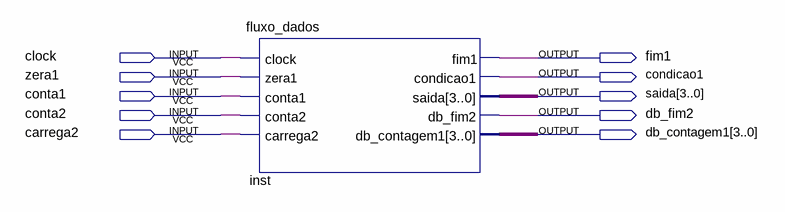
[diagram p0: schematic sheet]
// Quartus schematic fluxo_dados.bdf as structural Verilog: 1 symbols, 10 pins
module fluxo_dados (
  input  clock,
  input  zera1,
  input  conta1,
  input  conta2,
  input  carrega2,
  output fim1,
  output condicao1,
  output [3:0] saida,
  output db_fim2,
  output [3:0] db_contagem1
);

  fluxo_dados inst (
    .clock(clock), .zera1(zera1), .conta1(conta1), .conta2(conta2), .carrega2(carrega2), .fim1(fim1),
    .condicao1(condicao1), .saida(saida), .db_fim2(db_fim2), .db_contagem1(db_contagem1));
endmodule
